# EAGLE schematic gsm with usb power supply (2) (EAGLE 9.1.0)

## Sheet 1 of 3
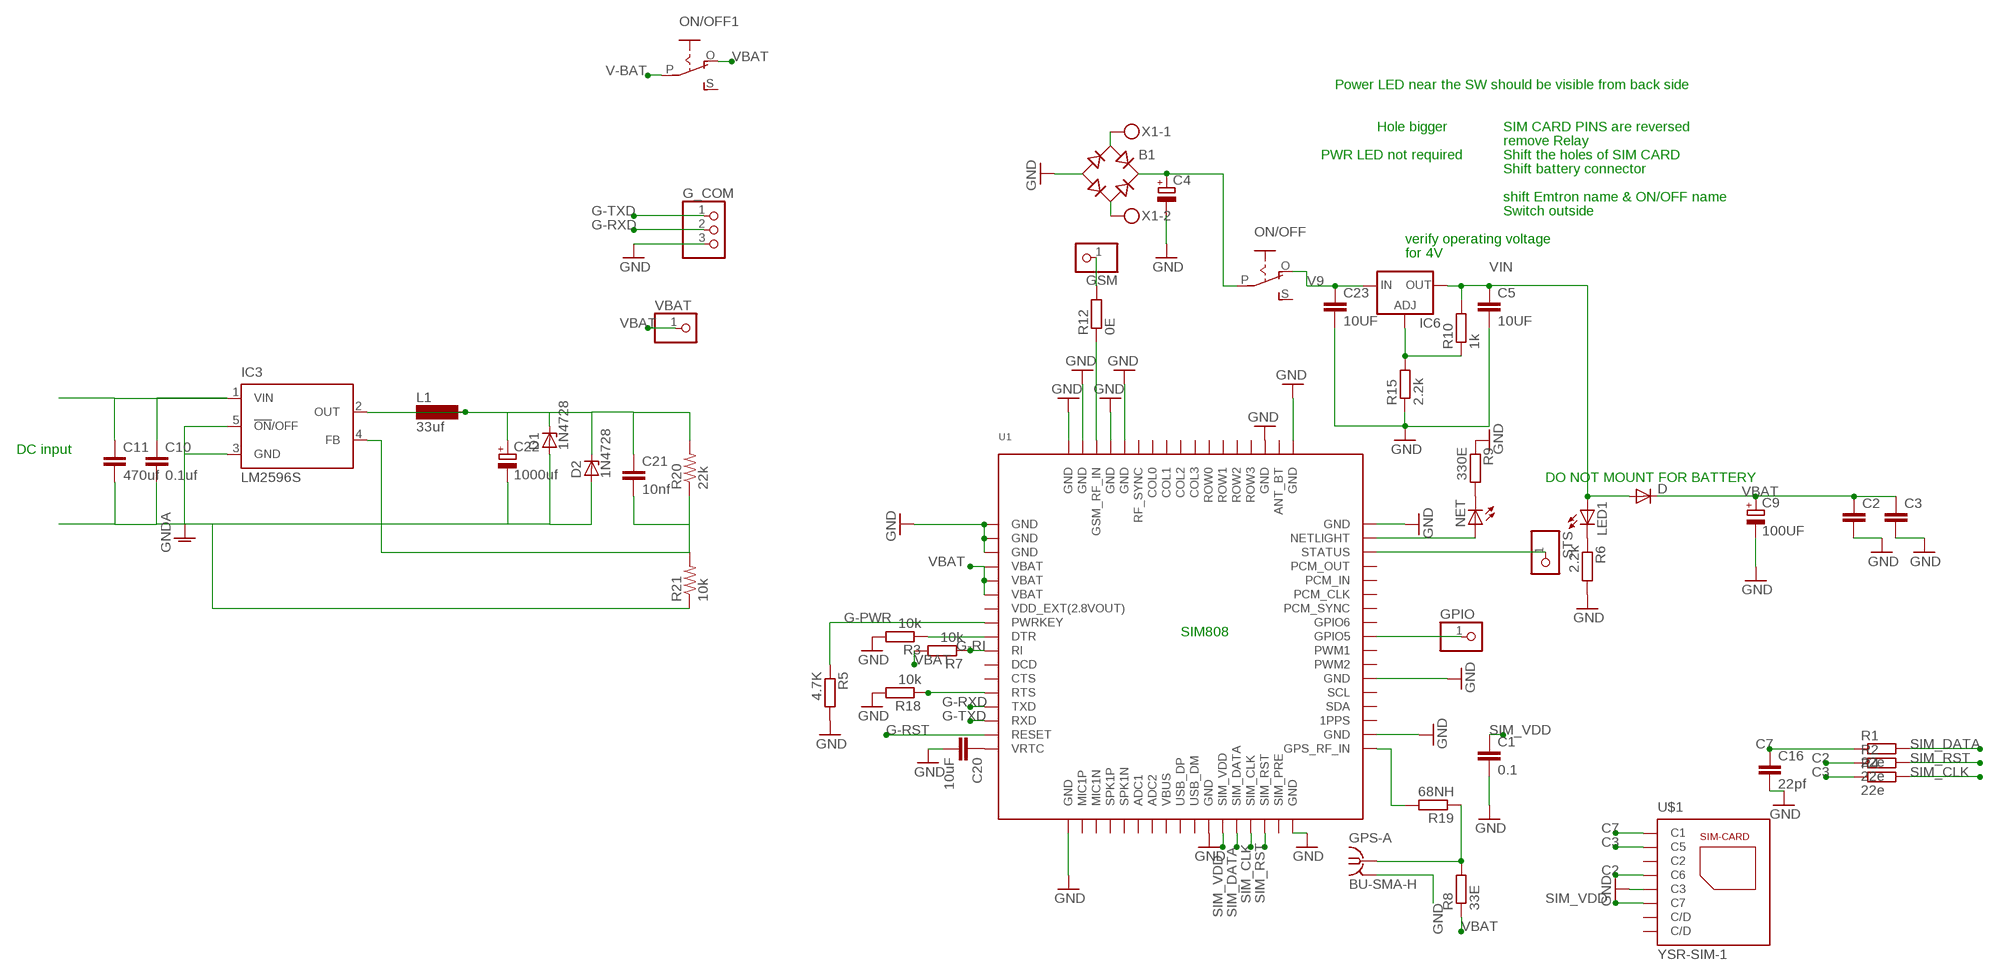
[diagram p0: schematic, sheet 1]

### Parts
B1  RB1A  [RB1A]
C1  0.1  C-EUC1206  [C1206]
C2  C-EUC1206  [C1206]
C3  C-EUC1206  [C1206]
C4  CPOL-EUE5-10.5  [E5-10,5]
C5  10UF  C-EUC1206K  [C1206K]
C9  100UF  CPOL-EUE3.5-8  [E3,5-8]
C10  0.1uf  C2,5-3  [C2.5-3]
C11  470uf  C2,5-3  [C2.5-3]
C16  22pf  C-EUC1206  [C1206]
C20  10uF  C-EUC1206K  [C1206K]
C21  10nf  C2,5-3  [C2.5-3]
C22  1000uf  CPOL-EU085CS-1AR  [085CS_1AR]
C23  10UF  C-EUC1206  [C1206]
D  1N4004  [DO41-10]
D1  1N4728  [DO41Z10]
D2  1N4728  [DO41Z10]
G_COM  PINHD-1X3  [1X03]
GPIO  PINHD-1X1  [1X01]
GPS-A  BU-SMA-H  [BU-SMA-H]
GSM  PINHD-1X1  [1X01]
IC3  LM2596S  [TO263-5]
IC6  LM317TS  [317TS]
L1  33uf  BS11  [BS11]
LED1  LEDCHIPLED_1206  [CHIPLED_1206]
NET  LEDCHIPLED_1206  [CHIPLED_1206]
ON/OFF  EG1218S  [EG1218]
ON/OFF1  EG1218S  [EG1218]
R1  22e  R-EU_M1206  [M1206]
R2  22e  R-EU_R1206  [R1206]
R3  10k  R-EU_R1206  [R1206]
R4  22e  R-EU_R1206  [R1206]
R5  4.7K  R-EU_R1206  [R1206]
R6  2.2k  R-EU_R1206  [R1206]
R7  10k  R-EU_R1206  [R1206]
R8  33E  R-EU_R1206  [R1206]
R9  330E  R-EU_R1206  [R1206]
R10  1k  R-EU_R1206  [R1206]
R12  0E  R-EU_R1206  [R1206]
R15  2.2k  R-EU_R1206  [R1206]
R18  10k  R-EU_R1206  [R1206]
R19  68NH  R-EU_R1206  [R1206]
R20  22k  R-US_0204/2V  [0204V]
R21  10k  R-US_0204/2V  [0204V]
STS  PINHD-1X1  [1X01]
U1  GSM_SIM808_LITERAL  [SIM900_SMT]
U$1  YSR-SIM-1  [5036_006_200_862]
VBAT  PINHD-1X1  [1X01]
X1  MKDSN1,5/2-5,08  [MKDSN1,5/2-5,08]

### Nets
C2: R2.1 U$1.C6
C3: R4.1 U$1.C5
C7: C16.1 R1.1 U$1.C1
G-PWR: R5.1 U1.P$8(PWRKEY) ; also sheet 2
G-RI: R7.1 U1.P$10(RI) ; also sheet 2
G-RST: U1.P$16(RESET) ; also sheet 2
G-RXD: G_COM.2 U1.P$14(TXD) ; also sheet 2
G-TXD: G_COM.1 U1.P$15(RXD) ; also sheet 2
GND: B1.- C1.2 C2.2 C3.2 C4.- C5.2 C9.- C16.2 C20.2 C23.2 G_COM.3 GPS-A.2 GPS-A.3 GPS-A.4 GPS-A.5 R3.2 R5.2 R6.2 R9.1 R15.1 R18.2 U1.P$1(GND) U1.P$2(GND) U1.P$3(GND) U1.P$18(GND) U1.P$28(GND) U1.P$34(GND) U1.P$36(GND) U1.P$40(GND) U1.P$51(GND) U1.P$52(GND) U1.P$54(GND) U1.P$64(GND) U1.P$65(GND) U1.P$67(GND) U1.P$68(GND) U$1.C3 ; also sheet 2,3
GNDA: C10.2 C11.2 C22.- D1.A D2.A IC3.3(GND) IC3.5(!ON!/OFF) R21.1
N$1: R3.1 U1.P$9(DTR)
N$2: NET.A U1.P$50(NETLIGHT)
N$3: STS.1 U1.P$49(STATUS)
N$4: C21.1 C22.+ D1.C D2.C IC3.2(OUT) L1.1 L1.2 R20.2
N$5: C21.2 IC3.4(FB) R20.1 R21.2
N$6: C10.1 C11.1 IC3.1(VIN)
N$7: R18.1 U1.P$13(RTS)
N$11: GPS-A.1 R8.2 R19.1
N$12: NET.C R9.2
N$13: B1.+ C4.+ ON/OFF.P
N$14: B1.AC1 X1.1
N$15: GPIO.1 U1.P$43(GPIO5)
N$18: C20.1 U1.P$17(VRTC)
N$19: B1.AC2 X1.2
N$22: GSM.1 R12.2
N$26: LED1.C R6.1
N$34: R12.1 U1.P$66(GSM_RF_IN)
N$38: R19.2 U1.P$35(GPS_RF_IN)
N$44: IC6.1(ADJ) R10.1 R15.2
SIM_CLK: R4.2 U1.P$31(SIM_CLK)
SIM_DATA: R1.2 U1.P$30(SIM_DATA)
SIM_RST: R2.2 U1.P$32(SIM_RST)
SIM_VDD: C1.1 U1.P$29(SIM_VDD) U$1.C7
V9: C23.1 IC6.3(IN) ON/OFF.O ; also sheet 2
V-BAT: ON/OFF1.P ; also sheet 3
VBAT: C2.1 C3.1 C9.+ D.C ON/OFF1.O R7.2 R8.1 U1.P$4(VBAT) U1.P$5(VBAT) U1.P$6(VBAT) VBAT.1 ; also sheet 2
VIN: C5.1 D.A IC6.2(OUT) LED1.A R10.2 ; also sheet 3
Unconnected: ON/OFF1.S ON/OFF.S U1.P$11(DCD) U1.P$12(CTS) U1.P$19(MIC1P) U1.P$20(MIC1N) U1.P$21(SPK1P) U1.P$22(SPK1N) U1.P$23(ADC1) U1.P$24(ADC2) U1.P$26(USB_DP) U1.P$27(USB_DM) U1.P$33(SIM_PRE) U1.P$37(1PPS) U1.P$38(SDA) U1.P$39(SCL) U1.P$41(PWM2) U1.P$42(PWM1) U1.P$44(GPIO6) U1.P$45(PCM_SYNC) U1.P$46(PCM_CLK) U1.P$47(PCM_IN) U1.P$48(PCM_OUT) U1.P$53(ANT_BT) U1.P$55(ROW3) U1.P$56(ROW2) U1.P$57(ROW1) U1.P$58(ROW0) U1.P$59(COL3) U1.P$60(COL2) U1.P$61(COL1) U1.P$62(COL0) U1.P$63(RF_SYNC) U$1.C2 U$1.C/D@1(C/D) U$1.C/D@2(C/D)

### Notes on the sheet
- Power LED near the SW should be visible from back side
- Hole bigger | SIM CARD PINS are reversed
- remove Relay
- PWR LED not required | Shift the holes of SIM CARD
- Shift battery connector
- shift Emtron name & ON/OFF name
- Switch outside
- verify operating voltage
- for 4V
- DC input
- DO NOT MOUNT FOR BATTERY
- SIM808

## Sheet 2 of 3
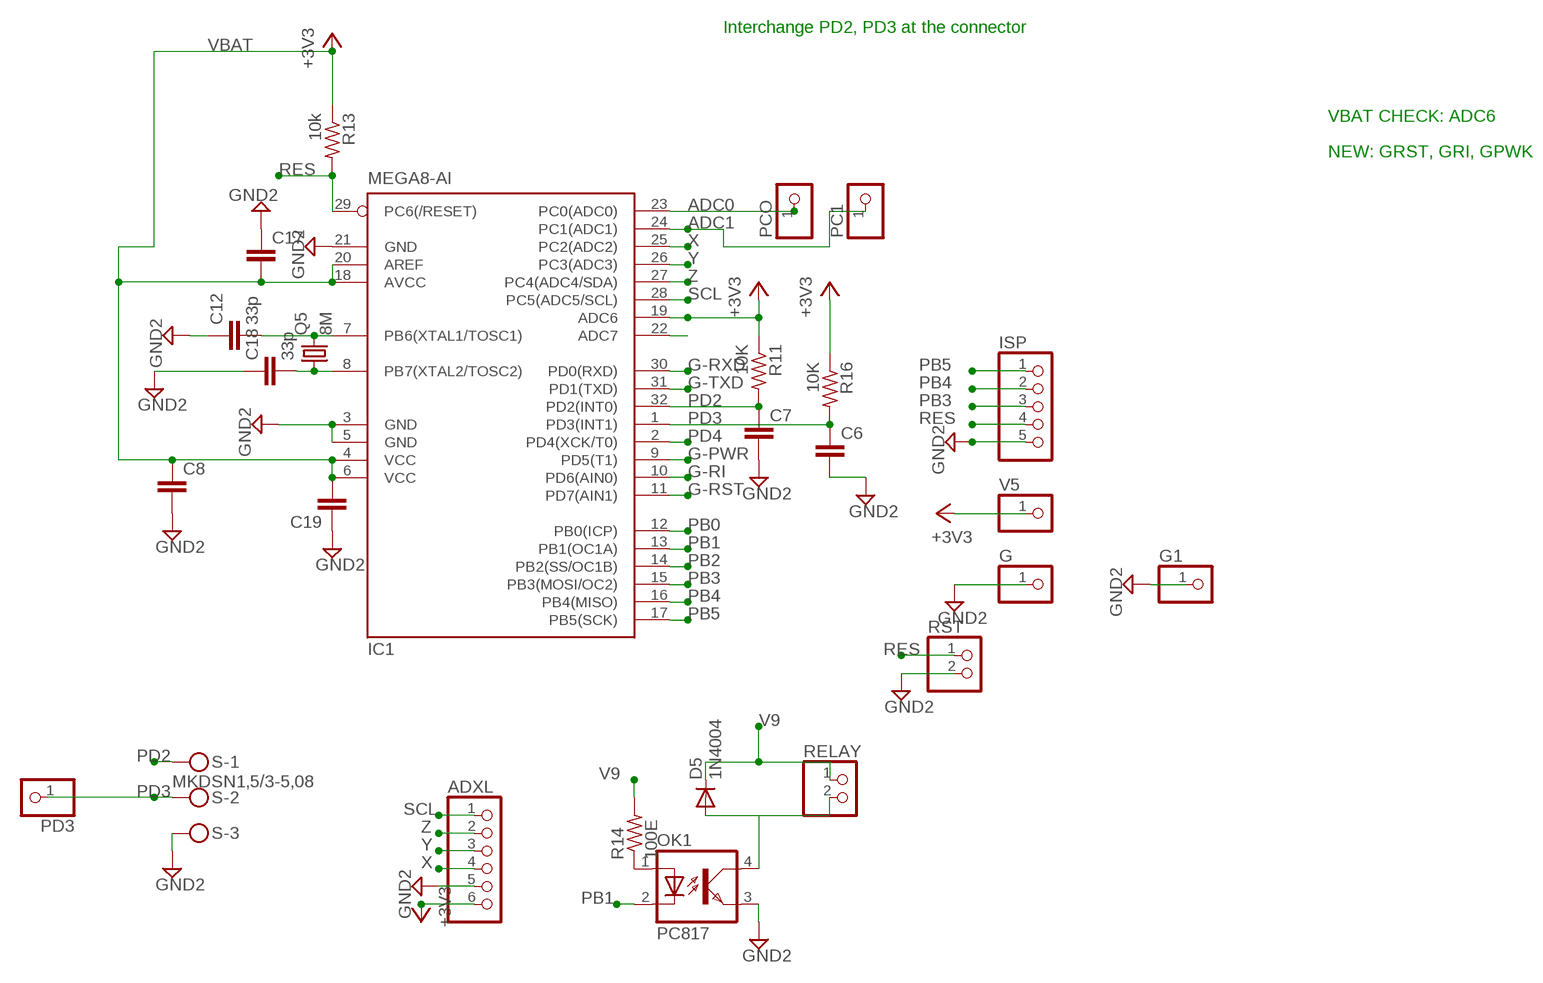
[diagram p1: schematic, sheet 2]

### Parts
ADXL  PINHD-1X6  [1X06]
C6  C-EUC1206  [C1206]
C7  C-EUC1206  [C1206]
C8  C-EUC1206K  [C1206K]
C12  33p  C-EUC1206  [C1206]
C17  C-EUC1206  [C1206]
C18  33p  C-EUC1206  [C1206]
C19  C-EUC1206  [C1206]
D5  1N4004  [DO41-10]
G  PINHD-1X1  [1X01]
G1  PINHD-1X1  [1X01]
IC1  MEGA8-AI  [TQFP32-08]
ISP  PINHD-1X5  [1X05]
OK1  PC817  [DIL04]
PC1  PINHD-1X1  [1X01]
PCO  PINHD-1X1  [1X01]
PD3  PINHD-1X1  [1X01]
Q5  8M  CRYSTALHC18U-V  [HC18U-V]
R11  10K  R-US_R1206  [R1206]
R13  10k  R-US_R1206  [R1206]
R14  100E  R-US_R1206  [R1206]
R16  10K  R-US_R1206  [R1206]
RELAY  PINHD-1X2  [1X02]
RST  PINHD-1X2  [1X02]
S  MKDSN1,5/3-5,08  [MKDSN1,5/3-5,08]
V5  PINHD-1X1  [1X01]

### Nets
ADC0: IC1.23(PC0(ADC0)) PCO.1
ADC1: IC1.24(PC1(ADC1)) PC1.1
G-PWR: IC1.9(PD5(T1)) ; also sheet 1
G-RI: IC1.10(PD6(AIN0)) ; also sheet 1
G-RST: IC1.11(PD7(AIN1)) ; also sheet 1
G-RXD: IC1.30(PD0(RXD)) ; also sheet 1
G-TXD: IC1.31(PD1(TXD)) ; also sheet 1
GND: ADXL.5 C6.2 C7.2 C8.2 C12.1 C17.1 C18.1 C19.1 G1.1 G.1 IC1.3(GND) IC1.5(GND) IC1.21(GND) ISP.5 OK1.3(EMIT) RST.2 S.3 ; supply symbol labelled GND2 ; also sheet 1,3
N$8: IC1.22(ADC7)
N$61: C12.2 IC1.7(PB6(XTAL1/TOSC1)) Q5.2
N$63: C18.2 IC1.8(PB7(XTAL2/TOSC2)) Q5.1
N$74: OK1.1(A) R14.1
N$77: D5.A OK1.4(COL) RELAY.2
PB0: IC1.12(PB0(ICP))
PB1: IC1.13(PB1(OC1A)) OK1.2(C)
PB2: IC1.14(PB2(SS/OC1B))
PB3: IC1.15(PB3(MOSI/OC2)) ISP.3
PB4: IC1.16(PB4(MISO)) ISP.2
PB5: IC1.17(PB5(SCK)) ISP.1
PD2: C7.1 IC1.32(PD2(INT0)) R11.2 S.1
PD3: C6.1 IC1.1(PD3(INT1)) PD3.1 R16.2 S.2
PD4: IC1.2(PD4(XCK/T0))
RES: IC1.29(PC6(/RESET)) ISP.4 R13.2 RST.1
SCL: ADXL.1 IC1.28(PC5(ADC5/SCL))
V9: D5.C R14.2 RELAY.1 ; also sheet 1
VBAT: ADXL.6 C8.1 C17.2 C19.2 IC1.4(VCC) IC1.6(VCC) IC1.18(AVCC) IC1.19(ADC6) IC1.20(AREF) R11.1 R13.1 R16.1 V5.1 ; supply symbol labelled +3V3 ; also sheet 1
X: ADXL.4 IC1.25(PC2(ADC2))
Y: ADXL.3 IC1.26(PC3(ADC3))
Z: ADXL.2 IC1.27(PC4(ADC4/SDA))

### Notes on the sheet
- Interchange PD2, PD3 at the connector
- VBAT CHECK: ADC6
- NEW: GRST, GRI, GPWK

## Sheet 3 of 3
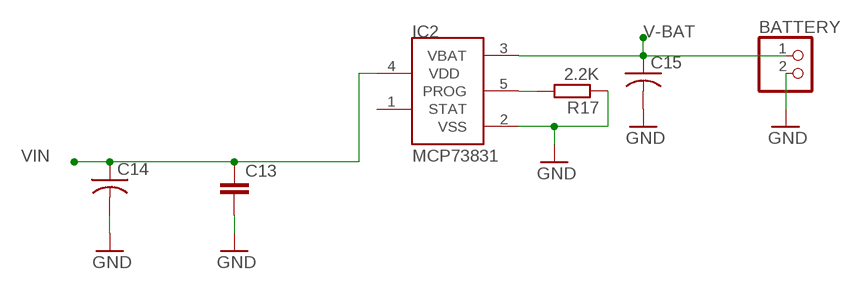
[diagram p2: schematic, sheet 3]

### Parts
BATTERY  PINHD-1X2  [1X02]
C13  C-EUC1206  [C1206]
C14  C-USC1206K  [C1206K]
C15  C-USC1206K  [C1206K]
IC2  MCP73831  [SOT23-5L]
R17  2.2K  R-EU_M1206  [M1206]

### Nets
GND: BATTERY.2 C13.2 C14.2 C15.2 IC2.2(VSS) R17.1 ; also sheet 1,2
N$16: IC2.5(PROG) R17.2
V-BAT: BATTERY.1 C15.1 IC2.3(VBAT) ; also sheet 1
VIN: C13.1 C14.1 IC2.4(VDD) ; also sheet 1
Unconnected: IC2.1(STAT)

## Power pins joined to a net without a drawn wire
VBUS: U1.P$25(VBUS)
VDD_EXT(2.8VOUT): U1.P$7(VDD_EXT(2.8VOUT))

## Library data of the parts
ADXL = pinhead:PINHD-1X6: PIN HEADER
B1 = rectifier:RB1A: RECTIFIER 1 A
BATTERY RELAY RST = pinhead:PINHD-1X2: PIN HEADER
C1 C16 C23 = rcl:C-EU: CAPACITOR, European symbol
C2 C3 C5-C8 C12 C13 C17-C20 = resistor:C-EU: CAPACITOR, European symbol
C4 C9 = resistor:CPOL-EU: POLARIZED CAPACITOR, European symbol
C10 C11 C21 = capacitor-wima:C: CAPACITOR naming: grid - package width
C14 C15 = resistor:C-US: CAPACITOR, American symbol
C22 = rcl:CPOL-EU: POLARIZED CAPACITOR, European symbol
D D5 = diode:1N4004: DIODE general purpose rectifier, 1 A
D1 D2 = diode:1N4728: Z DIODE 3.3 V, 1W, 5 percent
G G1 GPIO GSM PC1 PCO PD3 STS V5 VBAT = pinhead:PINHD-1X1: PIN HEADER
G_COM = pinhead:PINHD-1X3: PIN HEADER
GPS-A = con-coax:BU-SMA-H: FEMALE SMA CONNECTOR Radiall; OC_FARNELL: unknown; OC_NEWARK: unknown
IC1 = atmel:MEGA8: MICROCONTROLLER 8 Kbytes FLASH, 1 kbytes SRAM, 512 bytes EEPROM, USART, 6-channel 10 bit ADC, 2-channel 8 bit ADC Pin compatible with Atmega48, ATMega88, ATMega168 Source: avr.lbr
IC2 = microchip-update-2:MCP73831: Miniature Single-Cell, Fully Integrated Li-Ion, Li-Polymer Charge Management Controllers
IC3 = national-semiconductor (1):LM2596: SIMPLE SWITCHER® Power Converter 150 kHz 3A Step-Down Voltage Regulator Source: http://www.national.com/ds/LM/LM2596.pdf; MF: NATIONAL SEMICONDUCTOR; MPN: LM2596S-ADJ/NOPB; OC_FARNELL: 9494367; OC_NEWARK: 41K3842
IC6 = v-reg:LM317TS: VOLTAGE REGULATOR
ISP = pinhead:PINHD-1X5: PIN HEADER
L1 = inductor-neosid:BS: INDUCTOR nominal inductance, magnetically screened; OC_FARNELL: unknown; OC_NEWARK: unknown
LED1 NET = led:LED: LED OSRAM: - CHIPLED LG R971, LG N971, LY N971, LG Q971, LY Q971, LO R971, LY R971 LH N974, LH R974 LS Q976, LO Q976, LY Q976 LO Q996 - Hyper CHIPLED LW Q18S LB Q993, LB Q99A, LB R99A - SideLED LS A670, LO A670, LY A670, LG A670, LP A670 LB A673, LV A673, LT A673, LW A673 LH A674 LY A675 LS A676, LA A676, LO A676, LY A676, LW A676 LS A679, LY A679, LG A679 - Hyper Micro SIDELED® LS Y876, LA Y876, LO Y876, LY Y876 LT Y87S - SmartLED LW L88C, LW L88S LB L89C, LB L89S, LG L890 LS L89K, LO L89K, LY L89K LS L896, LA L896, LO L896, LY L896 - TOPLED LS T670, LO T670, LY T670, LG T670, LP T670 LSG T670, LSP T670, LSY T670, LOP T670, LYG T670 LG T671, LOG T671, LSG T671 LB T673, LV T673, LT T673, LW T673 LH T674 LS T676, LA T676, LO T676, LY T676, LB T676, LH T676, LSB T676, LW T676 LB T67C, LV T67C, LT T67C, LS T67K, LO T67K, LY T67K, LW E67C LS E67B, LA E67B, LO E67B, LY E67B, LB E67C, LV E67C, LT E67C LW T67C LS T679, LY T679, LG T679 LS T770, LO T770, LY T770, LG T770, LP T770 LB T773, LV T773, LT T773, LW T773 LH T774 LS E675, LA E675, LY E675, LS T675 LS T776, LA T776, LO T776, LY T776, LB T776 LHGB T686 LT T68C, LB T68C - Hyper Mini TOPLED® LB M676 - Mini TOPLED Santana® LG M470 LS M47K, LO M47K, LY M47K Source: http://www.osram.convergy.de LUXEON: - LUMILED® LXK2-PW12-R00, LXK2-PW12-S00, LXK2-PW14-U00, LXK2-PW14-V00 LXK2-PM12-R00, LXK2-PM12-S00, LXK2-PM14-U00 LXK2-PE12-Q00, LXK2-PE12-R00, LXK2-PE12-S00, LXK2-PE14-T00, LXK2-PE14-U00 LXK2-PB12-K00, LXK2-PB12-L00, LXK2-PB12-M00, LXK2-PB14-N00, LXK2-PB14-P00, LXK2-PB14-Q00 LXK2-PR12-L00, LXK2-PR12-M00, LXK2-PR14-Q00, LXK2-PR14-R00 LXK2-PD12-Q00, LXK2-PD12-R00, LXK2-PD12-S00 LXK2-PH12-R00, LXK2-PH12-S00 LXK2-PL12-P00, LXK2-PL12-Q00, LXK2-PL12-R00 Source: www.luxeon.com KINGBRIGHT: KA-3528ASYC Source: www.kingbright.com
OK1 = optocoupler:PC817: SHARP OPTO COUPLER; MPN: PC817X4J000F; OC_FARNELL: 9707727; OC_NEWARK: 97K7059
ON/OFF ON/OFF1 = adafruit:EG1218: SLIDING SWITCH 0.1" spacing through hole, vertical SPDT slide switch http://www.ladyada.net/library/pcb/eaglelibrary.html
Q5 = crystal:CRYSTAL: CRYSTAL; OC_FARNELL: unknown; OC_NEWARK: unknown
R1-R10 R12 R15 R17-R19 = rcl:R-EU_: RESISTOR, European symbol
R11 R13 R14 R16 = resistor:R-US_: RESISTOR, American symbol
R20 R21 = rcl:R-US_: RESISTOR, American symbol
S = con-phoenix-508:MKDSN1,5/3-5,08: MKDSN 1,5/ 3-5,08 Printklemme Nennstrom: 13,5 A Nennspannung: 250 V Rastermaß: 5,08 mm Polzahl: 3 Anschlussart: Schraubanschluss Montage: Löten Anschlussrichtung Leiter/Platine: 0 ° Artikelnummer: 1729131 Source: http://eshop.phoenixcontact.com .. 1729131.pdf; MPN: SMKDSN1,5/3-5,08; OC_FARNELL: 1792904; OC_NEWARK: 70R0299
U1 = adafruit:GSM_SIM808_LITERAL: SIM808 GSM Module
U$1 = SIM-YSR:YSR-SIM-1
X1 = con-phoenix-508:MKDSN1,5/2-5,08: MKDSN 1,5/ 2-5,08 Printklemme Nennstrom: 13,5 A Nennspannung: 250 V Rastermaß: 5,08 mm Polzahl: 2 Anschlussart: Schraubanschluss Montage: Löten Anschlussrichtung Leiter/Platine: 0 ° Artikelnummer: 1729128 Source: http://eshop.phoenixcontact.com .. 1729128.pdf; MPN: MKDSN 1,5/2-5.08; OC_FARNELL: 1792903; OC_NEWARK: 30M2397